# Altium schematic sheet 03.SAM2195.SchDoc
size A
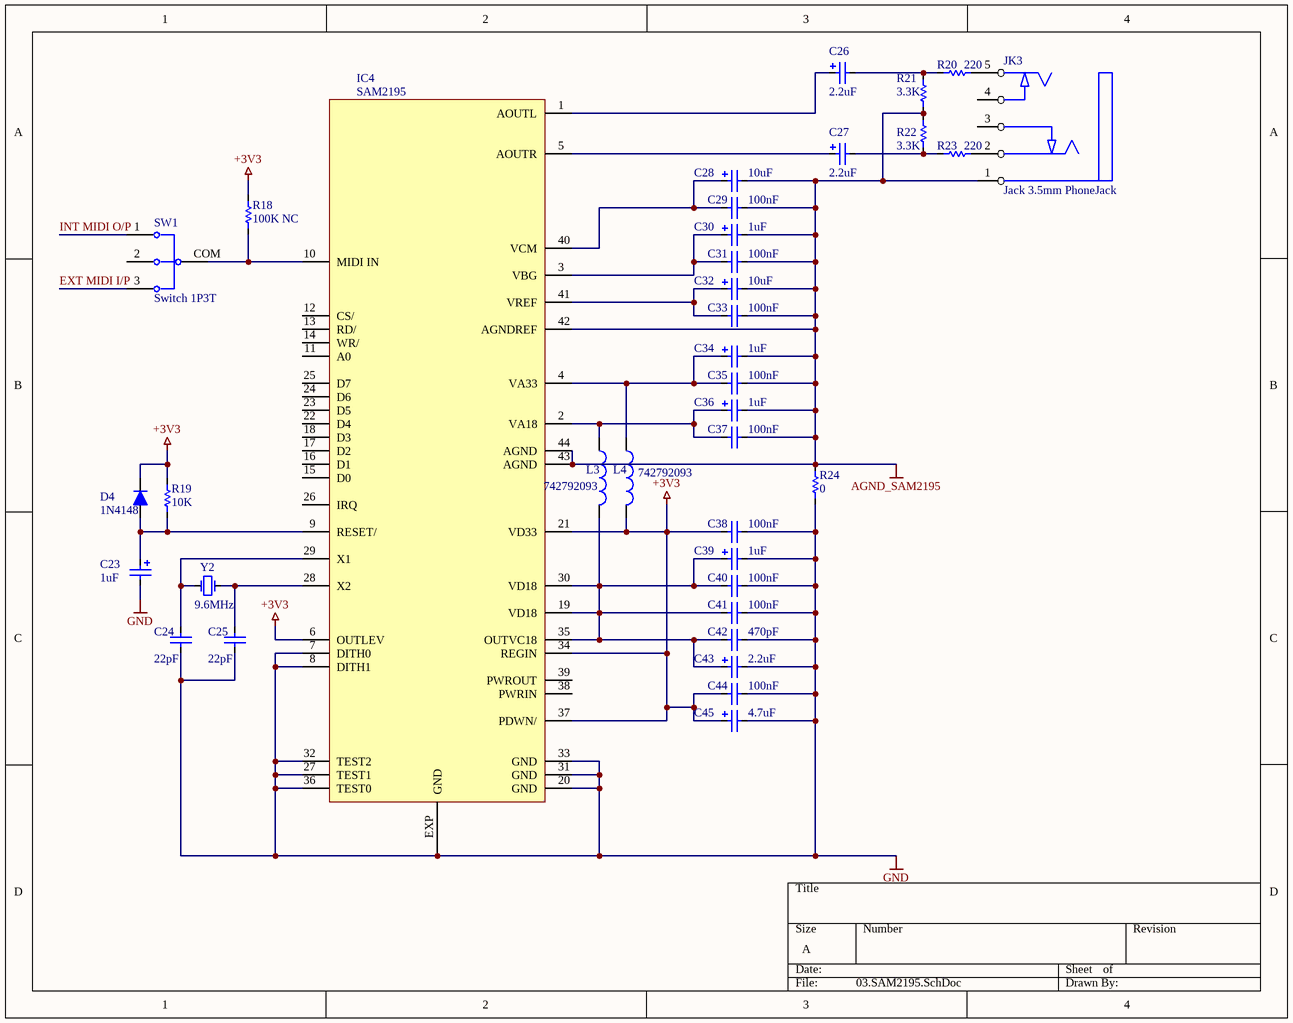
[diagram p0: 03.SAM2195.SchDoc]

## Parts
C23  1uF  [Cap SMD 4x5.3]
C24  22pF  [C0603-ROUND]
C25  22pF  [C0603-ROUND]
C26  2.2uF  [Cap SMD 4x5.3]
C27  2.2uF  [Cap SMD 4x5.3]
C28  10uF  [Cap SMD 4x5.3]
C29  100nF  [C0603-ROUND]
C30  1uF  [Cap SMD 4x5.3]
C31  100nF  [C0603-ROUND]
C32  10uF  [Cap SMD 4x5.3]
C33  100nF  [C0603-ROUND]
C34  1uF  [Cap SMD 4x5.3]
C35  100nF  [C0603-ROUND]
C36  1uF  [Cap SMD 4x5.3]
C37  100nF  [C0603-ROUND]
C38  100nF  [C0603-ROUND]
C39  1uF  [Cap SMD 4x5.3]
C40  100nF  [C0603-ROUND]
C41  100nF  [C0603-ROUND]
C42  470pF  [C0603-ROUND]
C43  2.2uF  [Cap SMD 4x5.3]
C44  100nF  [C0603-ROUND]
C45  4.7uF  [Cap SMD 4x5.3]
D4  1N4148  [SOD-323]
IC4  SAM2195
JK3  Jack 3.5mm PhoneJack  [PhoneJack EJ05-06-PF]
L3  742792093  [0805]
L4  742792093  [0805]
R18  100K NC  [R0603-ROUND]
R19  10K  [R0603-ROUND]
R20  220  [R0603-ROUND]
R21  3.3K  [R0603-ROUND]
R22  3.3K  [R0603-ROUND]
R23  220  [R0603-ROUND]
R24  0  [R0603-ROUND]
SW1  Switch 1P3T  [SW 1P3T - SS13D01]
Y2  9.6MHz  [HC-49S DIP]

## Nets
+3V3: C38.1 C44.1 C45.1 D4.2 IC4.6(OUTLEV) IC4.21(VD33) IC4.34(REGIN) IC4.37(PDWN/) L4.1 R18.1 R19.2
AGND_SAM2195: C28.2 C29.2 C30.2 C31.2 C32.2 C33.2 C34.2 C35.2 C36.2 C37.2 IC4.42(AGNDREF) IC4.43(AGND) IC4.44(AGND) JK3.1 R21.2 R22.1 R24.2
GND: C23.2 C24.1 C25.1 C38.2 C39.2 C40.2 C41.2 C42.2 C43.2 C44.2 C45.2 IC4.7(DITH0) IC4.8(DITH1) IC4.20(GND) IC4.27(TEST1) IC4.31(GND) IC4.32(TEST2) IC4.33(GND) IC4.36(TEST0) IC4.EXP(GND) R24.1
EXT MIDI I/P: SW1.3
INT MIDI O/P: SW1.1
NetC23_1: C23.1 D4.1 IC4.9(RESET/) R19.1
NetC24_2: C24.2 IC4.29(X1) Y2.2
NetC25_2: C25.2 IC4.28(X2) Y2.1
NetC26_1: C26.1 IC4.1(AOUTL)
NetC26_2: C26.2 R20.2 R21.1
NetC27_1: C27.1 IC4.5(AOUTR)
NetC27_2: C27.2 R22.2 R23.2
NetC28_1: C28.1 C29.1 IC4.40(VCM)
NetC30_1: C30.1 C31.1 IC4.3(VBG)
NetC32_1: C32.1 C33.1 IC4.41(VREF)
NetC34_1: C34.1 C35.1 IC4.4(VA33) L4.2
NetC36_1: C36.1 C37.1 IC4.2(VA18) L3.2
NetC39_1: C39.1 C40.1 C41.1 C42.1 C43.1 IC4.19(VD18) IC4.30(VD18) IC4.35(OUTVC18) L3.1
NetIC4_10: IC4.10(MIDI_IN) R18.2 SW1.COM(COMMON1)
NetJK3_2: JK3.2 R23.1
NetJK3_5: JK3.5 R20.1

Not connected (* = marked no-connect by the designer): IC4 11(A0) 12(CS/) 13(RD/) 14(WR/) 15(D0) 16(D1) 17(D2) 18(D3_) 22(D4) 23(D5) 24(D6) 25(D7_) 26(IRQ) 38(PWRIN) 39(PWROUT); JK3 3 4; SW1 2

## Library data of the parts
C23 C26-C28 C30 C32 C34 C36 C39 C43 C45 = Capacitor Polar
C24 C25 C29 C31 C33 C35 C37 C38 C40-C42 C44 = Capacitor Non-Polar
D4 = Diode 1N4148
IC4 = IC SAM2195
L3 L4 = Inductor: Code_IEC: 1005; Value: 10mH; Published: 8-Jun-2000; LatestRevisionDate: 29-May-2009; LatestRevisionNote: IPC-7351 Footprint Added.; PackageReference: 0402-A; Publisher: Altium Limited; PackageDescription: Chip Inductor; Code_JEITA: 0402
R18-R24 = Resistor
Y2 = Crystal